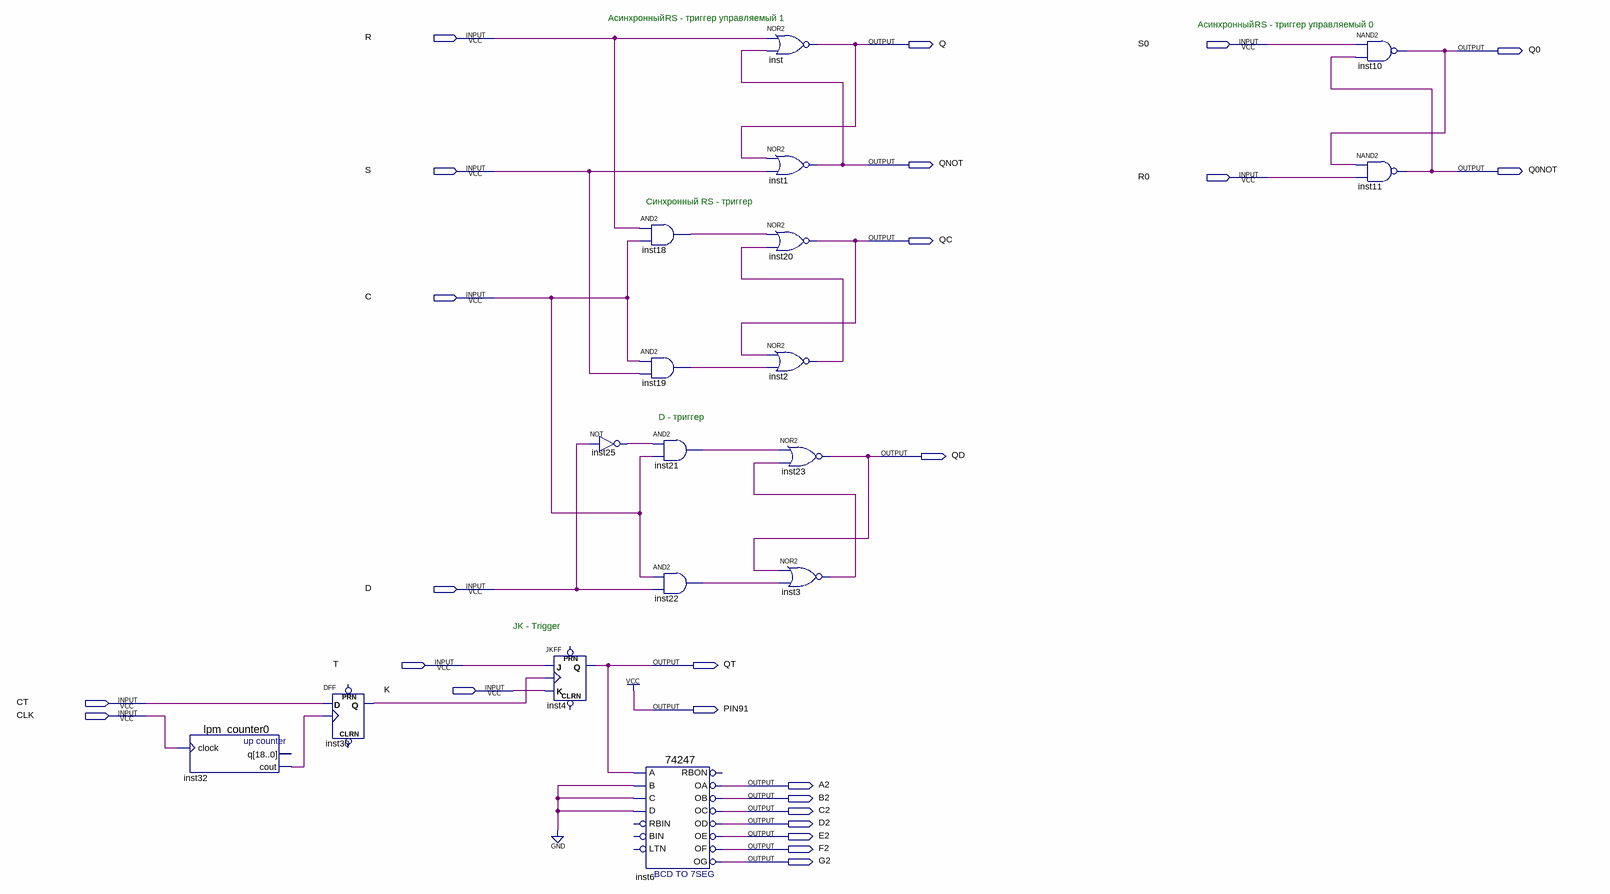
[diagram p0: schematic sheet]
// Quartus schematic trigger.bdf as structural Verilog: 17 symbols, 25 pins
module trigger (
  input  R,
  input  S0,
  input  S,
  input  R0,
  input  C,
  input  D,
  input  T,
  input  K,
  input  CT,
  input  CLK,
  output Q,
  output Q0,
  output QNOT,
  output Q0NOT,
  output QC,
  output QD,
  output QT,
  output PIN91,
  output A2,
  output B2,
  output C2,
  output D2,
  output E2,
  output F2,
  output G2
);

  wire inst2_out, inst3_out, inst18_out, inst19_out, inst21_out, inst22_out, inst25_out, inst30_q,
       inst32_cout;

  lpm_counter0 inst32 (.clock(CLK), .cout(inst32_cout));  // open: q
  DFF inst30 (.CLK(inst32_cout), .D(CT), .Q(inst30_q));  // open: CLRN, PRN
  JKFF inst4 (.K(K), .J(T), .CLK(inst30_q), .Q(QT));  // open: PRN, CLRN
  not inst25 (inst25_out, D);
  and inst18 (inst18_out, R, C);
  and inst19 (inst19_out, C, S);
  and inst21 (inst21_out, inst25_out, C);
  and inst22 (inst22_out, C, D);
  \74247  inst6 (
    .A(QT), .B(1'b0), .C(1'b0), .D(1'b0), .OF(F2), .OC(C2), .OD(D2), .OE(E2), .OA(A2), .OB(B2), .OG(G2));  // open: LTN, BIN, RBIN, RBON
  nor inst (Q, R, QNOT);
  nor inst1 (QNOT, Q, S);
  nor inst20 (QC, inst18_out, inst2_out);
  nor inst2 (inst2_out, QC, inst19_out);
  nor inst23 (QD, inst21_out, inst3_out);
  nor inst3 (inst3_out, QD, inst22_out);
  nand inst10 (Q0, S0, Q0NOT);
  nand inst11 (Q0NOT, Q0, R0);

  assign PIN91 = 1'b1;

  // Notes on the sheet:
  //   Асинхронный
  //   RS - триггер управляемый 1
  //   Асинхронный
  //   RS - триггер управляемый 0
  //   Синхронный RS - триггер
  //   D - триггер
  //   JK - Trigger
endmodule
